# EAGLE schematic REM_Scan_v2 (EAGLE 9.6.2)

## Sheet 1 of 5
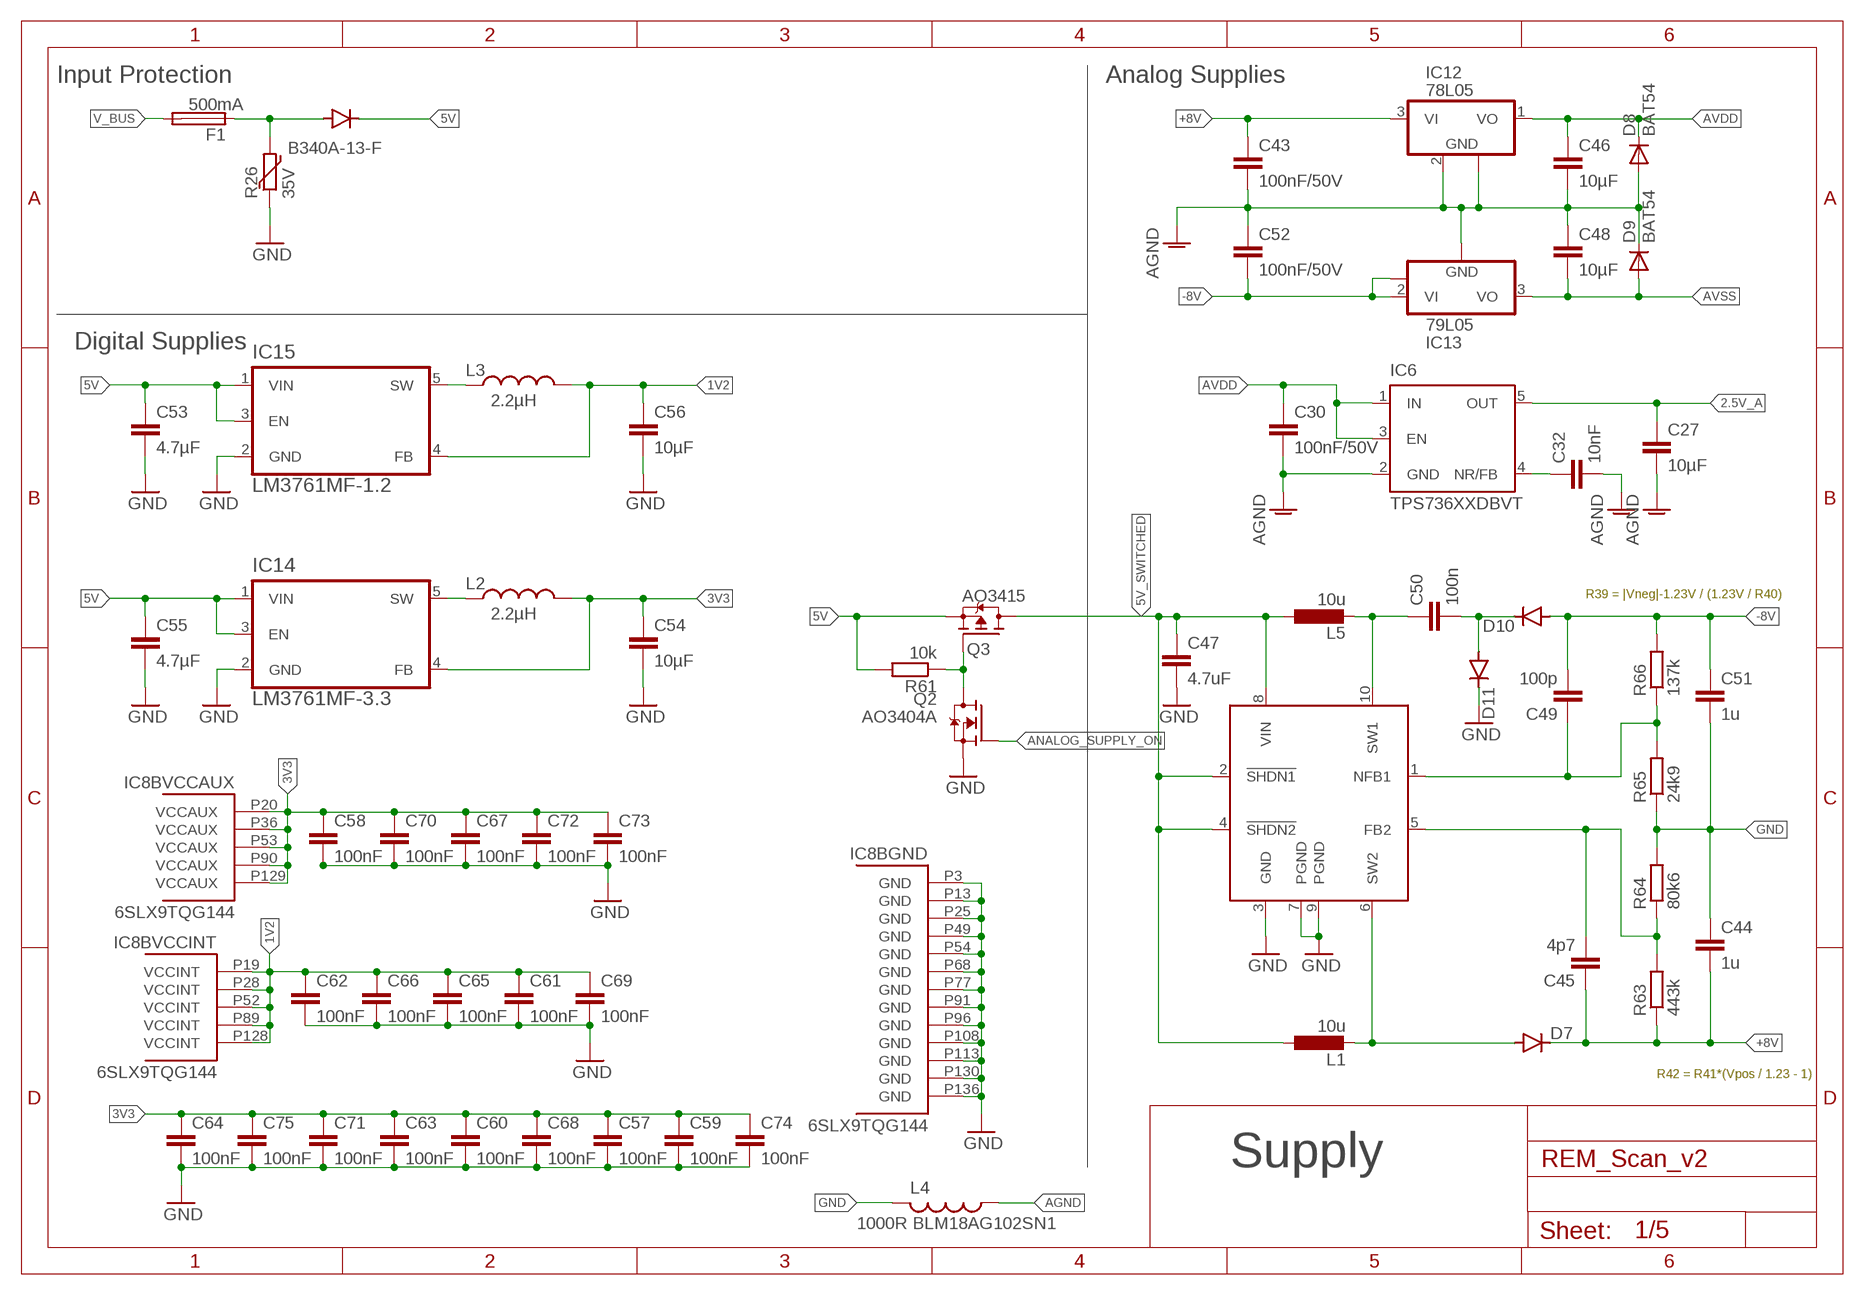
[diagram p0: schematic, sheet 1]

### Parts
C27  10µF  C-EUC0603  [C0603]
C30  100nF/50V  C-EUC0603  [C0603]
C32  10nF  C-EUC0603  [C0603]
C43  100nF/50V  C-EUC0603  [C0603]
C44  1u  C-EUC1206  [C1206]
C45  4p7  C-EUC0603  [C0603]
C46  10µF  C-EUC0603  [C0603]
C47  4.7uF  C-EUC3225  [C3225]
C48  10µF  C-EUC0603  [C0603]
C49  100p  C-EUC0603  [C0603]
C50  100n  C-EUC0603  [C0603]
C51  1u  C-EUC1206  [C1206]
C52  100nF/50V  C-EUC0603  [C0603]
C53  4.7µF  C-EUC0603  [C0603]
C54  10µF  C-EUC0603  [C0603]
C55  4.7µF  C-EUC0603  [C0603]
C56  10µF  C-EUC0603  [C0603]
C57  100nF  C-EUC0603  [C0603]
C58  100nF  C-EUC0603  [C0603]
C59  100nF  C-EUC0603  [C0603]
C60  100nF  C-EUC0603  [C0603]
C61  100nF  C-EUC0603  [C0603]
C62  100nF  C-EUC0603  [C0603]
C63  100nF  C-EUC0603  [C0603]
C64  100nF  C-EUC0603  [C0603]
C65  100nF  C-EUC0603  [C0603]
C66  100nF  C-EUC0603  [C0603]
C67  100nF  C-EUC0603  [C0603]
C68  100nF  C-EUC0603  [C0603]
C69  100nF  C-EUC0603  [C0603]
C70  100nF  C-EUC0603  [C0603]
C71  100nF  C-EUC0603  [C0603]
C72  100nF  C-EUC0603  [C0603]
C73  100nF  C-EUC0603  [C0603]
C74  100nF  C-EUC0603  [C0603]
C75  100nF  C-EUC0603  [C0603]
D3  B340A-13-F  DIODE-DO214AA  [DO214AA]
D7  DIODE-SOD323-W  [SOD323-W]
D8  BAT54  DIODE-SOD323-W  [SOD323-W]
D9  BAT54  DIODE-SOD323-W  [SOD323-W]
D10  DIODE-SOD323-W  [SOD323-W]
D11  DIODE-SOD323-W  [SOD323-W]
F1  500mA  FUSE1812  [1812]
IC6  TPS736XXDBVT  [SOT23-DBV]
IC8  6SLX9TQG144  [TQ144]
IC12  78L05  78L05F  [SOT89]
IC13  79L05  79L  [SOT89]
IC14  LM3761MF-3.3  LM3671  [SOT95P284X122-5N]
IC15  LM3761MF-1.2  LM3671  [SOT95P284X122-5N]
IC16  LT1945  [MSOP10]
L1  10u  L-EUL3225P  [L3225P]
L2  2.2µH  DO3314  [SO3314]
L3  2.2µH  DO3314  [SO3314]
L4  1000R BLM18AG102SN1  L-USL2012C  [L2012C]
L5  10u  L-EUL3225P  [L3225P]
Q2  AO3404A  N-MOSFET-SOT23-3  [SOT23]
Q3  AO3415  TSM2311CX  [SOT95P280X130-3N]
R26  35V  MOV-EU_1206  [R1206]
R61  10k  R-EU_R0603  [R0603]
R63  443k  R-EU_R0603  [R0603]
R64  80k6  R-EU_R0603  [R0603]
R65  24k9  R-EU_R0603  [R0603]
R66  137k  R-EU_R0603  [R0603]

### Nets
1V2: C56.1 C61.1 C62.1 C65.1 C66.1 C69.1 IC8.P19(BVCCINT:VCCINT) IC8.P28(BVCCINT:VCCINT) IC8.P52(BVCCINT:VCCINT) IC8.P89(BVCCINT:VCCINT) IC8.P128(BVCCINT:VCCINT) IC15.4(FB) L3.2
2.5V_A: C27.1 IC6.5(OUT) ; also sheet 3
3V3: C54.1 C57.1 C58.1 C59.1 C60.1 C63.1 C64.1 C67.1 C68.1 C70.1 C71.1 C72.1 C73.1 C74.1 C75.1 IC8.P20(BVCCAUX:VCCAUX) IC8.P36(BVCCAUX:VCCAUX) IC8.P53(BVCCAUX:VCCAUX) IC8.P90(BVCCAUX:VCCAUX) IC8.P129(BVCCAUX:VCCAUX) IC14.4(FB) L2.2 ; also sheet 2,3,4,5
5V: C53.1 C55.1 D3.C IC14.1(VIN) IC14.3(EN) IC15.1(VIN) IC15.3(EN) Q3.2(S) R61.2 ; also sheet 2
5V_SWITCHED: C47.1 IC16.2(!SHDN1) IC16.4(!SHDN2) IC16.8(VIN) L1.1 L5.1 Q3.3(D)
+8V: C43.1 C44.2 C45.1 D7.C IC12.3(VI) R63.1 ; also sheet 3
-8V: C49.2 C51.1 C52.2 D10.A IC13.2(VI) IC13.2@1(VIN) R66.2
AGND: C27.2 C30.2 C32.2 C43.2 C46.2 C48.1 C52.1 D8.A D9.C IC6.2(GND) IC12.2(GND) IC12.2@1(GND) IC13.1(GND) L4.1 ; also sheet 2,3,4
ANALOG_SUPPLY_ON: Q2.1(G) ; also sheet 2
AVDD: C30.1 C46.1 D8.C IC6.1(IN) IC6.3(EN) IC12.1(VO) ; also sheet 3,4
AVSS: C48.2 D9.A IC13.3(VO) ; also sheet 3,4
GND: C44.1 C47.2 C51.2 C53.2 C54.2 C55.2 C56.2 C57.2 C58.2 C59.2 C60.2 C61.2 C62.2 C63.2 C64.2 C65.2 C66.2 C67.2 C68.2 C69.2 C70.2 C71.2 C72.2 C73.2 C74.2 C75.2 D11.C IC8.P3(BGND:GND) IC8.P13(BGND:GND) IC8.P25(BGND:GND) IC8.P49(BGND:GND) IC8.P54(BGND:GND) IC8.P68(BGND:GND) IC8.P77(BGND:GND) IC8.P91(BGND:GND) IC8.P96(BGND:GND) IC8.P108(BGND:GND) IC8.P113(BGND:GND) IC8.P130(BGND:GND) IC8.P136(BGND:GND) IC14.2(GND) IC15.2(GND) IC16.3(GND) IC16.7(PGND) IC16.9(PGND) L4.2 Q2.2(S) R26.1 R64.2 R65.1 ; also sheet 2,3,4,5
N$3: IC15.5(SW) L3.1
N$00014: C32.1 IC6.4(NR/FB)
N$00016: C50.1 IC16.10(SW1) L5.2
N$00018: C50.2 D10.C D11.A
N$00019: D7.A IC16.6(SW2) L1.2
N$00029: C49.1 IC16.1(NFB1) R65.2 R66.1
N$00031: Q2.3(D) Q3.1(G) R61.1
N$00032: C45.2 IC16.5(FB2) R63.2 R64.1
N$50: IC14.5(SW) L2.1
SUPPLY_SEC: D3.A F1.1 R26.2
V_BUS: F1.2 ; also sheet 5

### Notes on the sheet
- Input Protection | Analog Supplies
- Digital Supplies
- R39 = |Vneg|-1.23V / (1.23V / R40)
- R42 = R41*(Vpos / 1.23 - 1)
- Supply

## Sheet 2 of 5
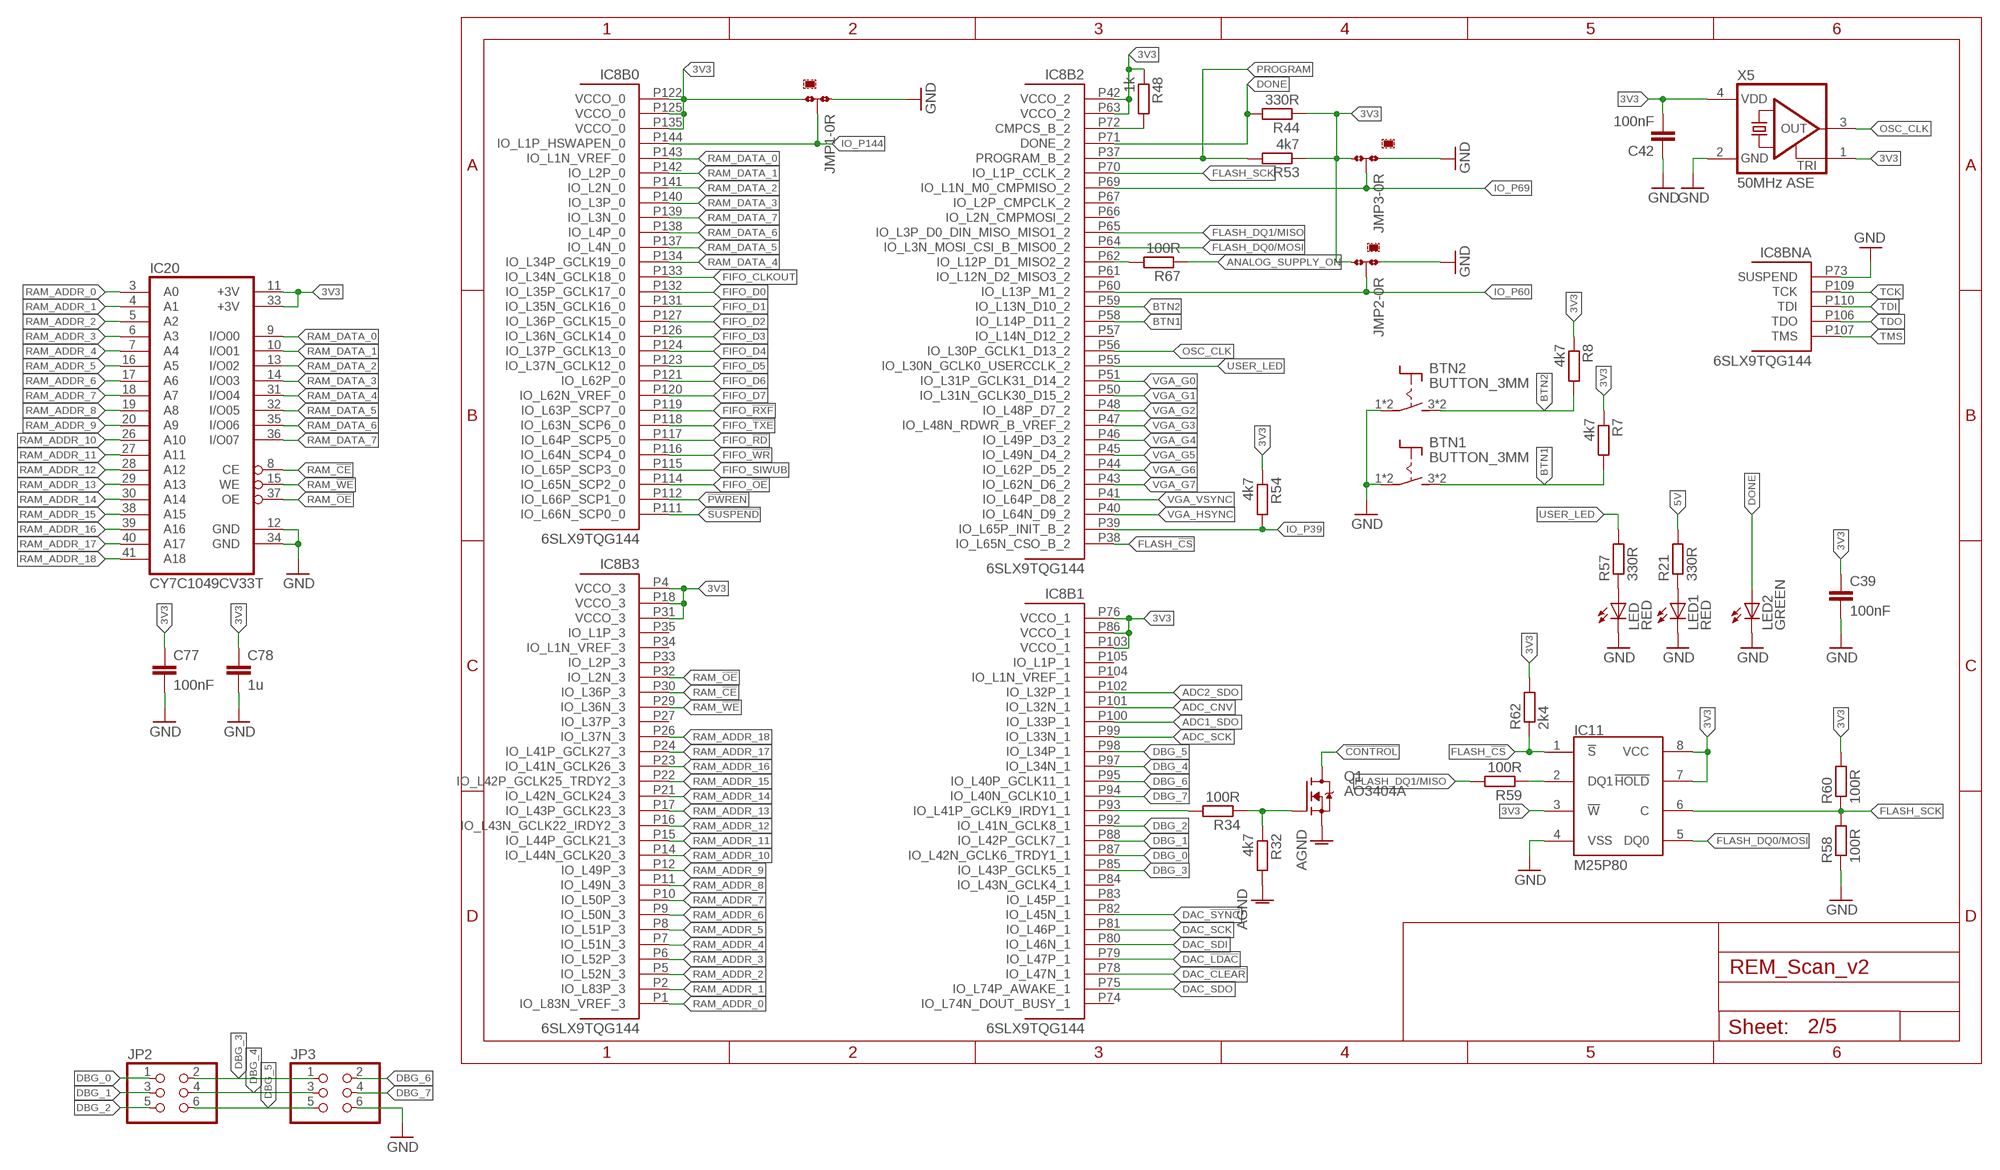
[diagram p1: schematic, sheet 2]

### Parts
BTN1  BUTTON_3MM  [BUTTON_3MM]
BTN2  BUTTON_3MM  [BUTTON_3MM]
C39  100nF  C-EUC0603  [C0603]
C42  100nF  C-EUC0603  [C0603]
C77  100nF  C-EUC0603  [C0603]
C78  1u  C-EUC1206  [C1206]
IC11  M25P80  [SO-08]
IC20  CY7C1049CV33T  [TSOPII-Z44]
JMP1  1k  0R-JUMPA  [A0R-JMP]
JMP2  1k  0R-JUMPA  [A0R-JMP]
JMP3  1k  0R-JUMPA  [A0R-JMP]
JP2  PINHD-2X3_2.54  [2X03]
JP3  PINHD-2X3_2.54  [2X03]
LED  RED  LEDCHIP-LED0603  [CHIP-LED0603]
LED1  RED  LEDCHIP-LED0603  [CHIP-LED0603]
LED2  GREEN  LEDCHIP-LED0603  [CHIP-LED0603]
Q1  AO3404A  N-MOSFET-SOT23-3  [SOT23]
R7  4k7  R-EU_R0603  [R0603]
R8  4k7  R-EU_R0603  [R0603]
R21  330R  R-EU_R0603  [R0603]
R32  4k7  R-EU_R0603  [R0603]
R34  100R  R-EU_R0603  [R0603]
R44  330R  R-EU_R0603  [R0603]
R48  1k  R-EU_R0603  [R0603]
R53  4k7  R-EU_R0603  [R0603]
R54  4k7  R-EU_R0603  [R0603]
R57  330R  R-EU_R0603  [R0603]
R58  100R  R-EU_R0603  [R0603]
R59  100R  R-EU_R0603  [R0603]
R60  100R  R-EU_R0603  [R0603]
R62  2k4  R-EU_R0603  [R0603]
R67  100R  R-EU_R0603  [R0603]
X5  50MHz ASE  ASE  [ASE]

### Nets
3V3: C39.1 C42.2 C77.1 C78.1 IC8.P4(B3:VCCO_3) IC8.P18(B3:VCCO_3) IC8.P31(B3:VCCO_3) IC8.P42(B2:VCCO_2) IC8.P63(B2:VCCO_2) IC8.P76(B1:VCCO_1) IC8.P86(B1:VCCO_1) IC8.P103(B1:VCCO_1) IC8.P122(B0:VCCO_0) IC8.P125(B0:VCCO_0) IC8.P135(B0:VCCO_0) IC11.3(!W) IC11.7(!HOLD) IC11.8(VCC) IC20.11(+3V) IC20.33(+3V) JMP1.3 JMP2.3 JMP3.3 R7.1 R8.1 R44.1 R48.1 R53.1 R54.1 R60.2 R62.2 X5.1(TRI) X5.4(VDD) ; also sheet 1,3,4,5
5V: R21.2 ; also sheet 1
!CONTROL: Q1.3(D) ; also sheet 4
!PWREN: IC8.P112(B0:IO_L66P_SCP1_0) ; also sheet 5
!SUSPEND: IC8.P111(B0:IO_L66N_SCP0_0) ; also sheet 5
ADC1_SDO: IC8.P100(B1:IO_L33P_1) ; also sheet 3
ADC2_SDO: IC8.P102(B1:IO_L32P_1) ; also sheet 3
ADC_CNV: IC8.P101(B1:IO_L32N_1) ; also sheet 3
ADC_SCK: IC8.P99(B1:IO_L33N_1) ; also sheet 3
AGND: Q1.2(S) R32.2 ; also sheet 1,3,4
ANALOG_SUPPLY_ON: R67.1 ; also sheet 1
BTN1: BTN1.3(S) BTN1.4(S) IC8.P58(B2:IO_L14P_D11_2) R7.2
BTN2: BTN2.3(S) BTN2.4(S) IC8.P59(B2:IO_L13N_D10_2) R8.2
DAC_!CLEAR: IC8.P78(B1:IO_L47N_1) ; also sheet 4
DAC_!LDAC: IC8.P79(B1:IO_L47P_1) ; also sheet 4
DAC_!SYNC: IC8.P82(B1:IO_L45N_1) ; also sheet 4
DAC_SCK: IC8.P81(B1:IO_L46P_1) ; also sheet 4
DAC_SDI: IC8.P80(B1:IO_L46N_1) ; also sheet 4
DAC_SDO: IC8.P75(B1:IO_L74P_AWAKE_1) ; also sheet 4
DBG_0: IC8.P87(B1:IO_L42N_GCLK6_TRDY1_1) JP2.1
DBG_1: IC8.P88(B1:IO_L42P_GCLK7_1) JP2.3
DBG_2: IC8.P92(B1:IO_L41N_GCLK8_1) JP2.5
DBG_3: IC8.P85(B1:IO_L43P_GCLK5_1) JP2.2 JP3.1
DBG_4: IC8.P97(B1:IO_L34N_1) JP2.4 JP3.3
DBG_5: IC8.P98(B1:IO_L34P_1) JP2.6 JP3.5
DBG_6: IC8.P95(B1:IO_L40P_GCLK11_1) JP3.2
DBG_7: IC8.P94(B1:IO_L40N_GCLK10_1) JP3.4
DONE: IC8.P71(B2:DONE_2) LED2.A R44.2
FIFO_!OE: IC8.P114(B0:IO_L65N_SCP2_0) ; also sheet 5
FIFO_!RD: IC8.P117(B0:IO_L64P_SCP5_0) ; also sheet 5
FIFO_!RXF: IC8.P119(B0:IO_L63P_SCP7_0) ; also sheet 5
FIFO_!TXE: IC8.P118(B0:IO_L63N_SCP6_0) ; also sheet 5
FIFO_!WR: IC8.P116(B0:IO_L64N_SCP4_0) ; also sheet 5
FIFO_CLKOUT: IC8.P133(B0:IO_L34N_GCLK18_0) ; also sheet 5
FIFO_D0: IC8.P132(B0:IO_L35P_GCLK17_0) ; also sheet 5
FIFO_D1: IC8.P131(B0:IO_L35N_GCLK16_0) ; also sheet 5
FIFO_D2: IC8.P127(B0:IO_L36P_GCLK15_0) ; also sheet 5
FIFO_D3: IC8.P126(B0:IO_L36N_GCLK14_0) ; also sheet 5
FIFO_D4: IC8.P124(B0:IO_L37P_GCLK13_0) ; also sheet 5
FIFO_D5: IC8.P123(B0:IO_L37N_GCLK12_0) ; also sheet 5
FIFO_D6: IC8.P121(B0:IO_L62P_0) ; also sheet 5
FIFO_D7: IC8.P120(B0:IO_L62N_VREF_0) ; also sheet 5
FIFO_SIWUB: IC8.P115(B0:IO_L65P_SCP3_0) ; also sheet 5
FLASH_!CS: IC8.P38(B2:IO_L65N_CSO_B_2) IC11.1(!S) R62.1
FLASH_DQ0/MOSI: IC8.P64(B2:IO_L3N_MOSI_CSI_B_MISO0_2) IC11.5(DQ0)
FLASH_DQ1/MISO: IC8.P65(B2:IO_L3P_D0_DIN_MISO_MISO1_2) R59.2
FLASH_SCK: IC8.P70(B2:IO_L1P_CCLK_2) IC11.6(C) R58.2 R60.1
GND: BTN1.1(P) BTN1.2(P) BTN2.1(P) BTN2.2(P) C39.2 C42.1 C77.2 C78.2 IC8.P73(BNA:SUSPEND) IC11.4(VSS) IC20.12(GND) IC20.34(GND) JMP1.1 JMP2.1 JMP3.1 JP3.6 LED1.C LED2.C LED.C R58.1 X5.2(GND) ; also sheet 1,3,4,5
IO_P39: IC8.P39(B2:IO_L65P_INIT_B_2) R54.2
IO_P60: IC8.P60(B2:IO_L13P_M1_2) JMP2.2
IO_P69: IC8.P69(B2:IO_L1N_M0_CMPMISO_2) JMP3.2
IO_P144: IC8.P144(B0:IO_L1P_HSWAPEN_0) JMP1.2
N$1: IC11.2(DQ1) R59.1
N$5: LED1.A R21.1
N$00006: Q1.1(G) R32.1 R34.1
N$7: IC8.P72(B2:CMPCS_B_2) R48.2
N$00008: IC8.P93(B1:IO_L41P_GCLK9_IRDY1_1) R34.2
N$00030: LED.A R57.1
N$00035: IC8.P62(B2:IO_L12P_D1_MISO2_2) R67.2
OSC_CLK: IC8.P56(B2:IO_L30P_GCLK1_D13_2) X5.3(OUT)
PROGRAM: IC8.P37(B2:PROGRAM_B_2) R53.2
RAM_!CE: IC8.P30(B3:IO_L36P_3) IC20.8(CE)
RAM_!OE: IC8.P32(B3:IO_L2N_3) IC20.37(OE)
RAM_!WE: IC8.P29(B3:IO_L36N_3) IC20.15(WE)
RAM_ADDR_0: IC8.P1(B3:IO_L83N_VREF_3) IC20.3(A0)
RAM_ADDR_1: IC8.P2(B3:IO_L83P_3) IC20.4(A1)
RAM_ADDR_2: IC8.P5(B3:IO_L52N_3) IC20.5(A2)
RAM_ADDR_3: IC8.P6(B3:IO_L52P_3) IC20.6(A3)
RAM_ADDR_4: IC8.P7(B3:IO_L51N_3) IC20.7(A4)
RAM_ADDR_5: IC8.P8(B3:IO_L51P_3) IC20.16(A5)
RAM_ADDR_6: IC8.P9(B3:IO_L50N_3) IC20.17(A6)
RAM_ADDR_7: IC8.P10(B3:IO_L50P_3) IC20.18(A7)
RAM_ADDR_8: IC8.P11(B3:IO_L49N_3) IC20.19(A8)
RAM_ADDR_9: IC8.P12(B3:IO_L49P_3) IC20.20(A9)
RAM_ADDR_10: IC8.P14(B3:IO_L44N_GCLK20_3) IC20.26(A10)
RAM_ADDR_11: IC8.P15(B3:IO_L44P_GCLK21_3) IC20.27(A11)
RAM_ADDR_12: IC8.P16(B3:IO_L43N_GCLK22_IRDY2_3) IC20.28(A12)
RAM_ADDR_13: IC8.P17(B3:IO_L43P_GCLK23_3) IC20.29(A13)
RAM_ADDR_14: IC8.P21(B3:IO_L42N_GCLK24_3) IC20.30(A14)
RAM_ADDR_15: IC8.P22(B3:IO_L42P_GCLK25_TRDY2_3) IC20.38(A15)
RAM_ADDR_16: IC8.P23(B3:IO_L41N_GCLK26_3) IC20.39(A16)
RAM_ADDR_17: IC8.P24(B3:IO_L41P_GCLK27_3) IC20.40(A17)
RAM_ADDR_18: IC8.P26(B3:IO_L37N_3) IC20.41(A18)
RAM_DATA_0: IC8.P143(B0:IO_L1N_VREF_0) IC20.9(I/O00)
RAM_DATA_1: IC8.P142(B0:IO_L2P_0) IC20.10(I/O01)
RAM_DATA_2: IC8.P141(B0:IO_L2N_0) IC20.13(I/O02)
RAM_DATA_3: IC8.P140(B0:IO_L3P_0) IC20.14(I/O03)
RAM_DATA_4: IC8.P134(B0:IO_L34P_GCLK19_0) IC20.31(I/O04)
RAM_DATA_5: IC8.P137(B0:IO_L4N_0) IC20.32(I/O05)
RAM_DATA_6: IC8.P138(B0:IO_L4P_0) IC20.35(I/O06)
RAM_DATA_7: IC8.P139(B0:IO_L3N_0) IC20.36(I/O07)
TCK: IC8.P109(BNA:TCK) ; also sheet 5
TDI: IC8.P110(BNA:TDI) ; also sheet 5
TDO: IC8.P106(BNA:TDO) ; also sheet 5
TMS: IC8.P107(BNA:TMS) ; also sheet 5
USER_LED: IC8.P55(B2:IO_L30N_GCLK0_USERCCLK_2) R57.2
VGA_G0: IC8.P51(B2:IO_L31P_GCLK31_D14_2) ; also sheet 4
VGA_G1: IC8.P50(B2:IO_L31N_GCLK30_D15_2) ; also sheet 4
VGA_G2: IC8.P48(B2:IO_L48P_D7_2) ; also sheet 4
VGA_G3: IC8.P47(B2:IO_L48N_RDWR_B_VREF_2) ; also sheet 4
VGA_G4: IC8.P46(B2:IO_L49P_D3_2) ; also sheet 4
VGA_G5: IC8.P45(B2:IO_L49N_D4_2) ; also sheet 4
VGA_G6: IC8.P44(B2:IO_L62P_D5_2) ; also sheet 4
VGA_G7: IC8.P43(B2:IO_L62N_D6_2) ; also sheet 4
VGA_HSYNC: IC8.P40(B2:IO_L64N_D9_2) ; also sheet 4
VGA_VSYNC: IC8.P41(B2:IO_L64P_D8_2) ; also sheet 4
Unconnected: IC8.P27(B3:IO_L37P_3) IC8.P33(B3:IO_L2P_3) IC8.P34(B3:IO_L1N_VREF_3) IC8.P35(B3:IO_L1P_3) IC8.P57(B2:IO_L14N_D12_2) IC8.P61(B2:IO_L12N_D2_MISO3_2) IC8.P66(B2:IO_L2N_CMPMOSI_2) IC8.P67(B2:IO_L2P_CMPCLK_2) IC8.P74(B1:IO_L74N_DOUT_BUSY_1) IC8.P83(B1:IO_L45P_1) IC8.P84(B1:IO_L43N_GCLK4_1) IC8.P104(B1:IO_L1N_VREF_1) IC8.P105(B1:IO_L1P_1)

## Sheet 3 of 5
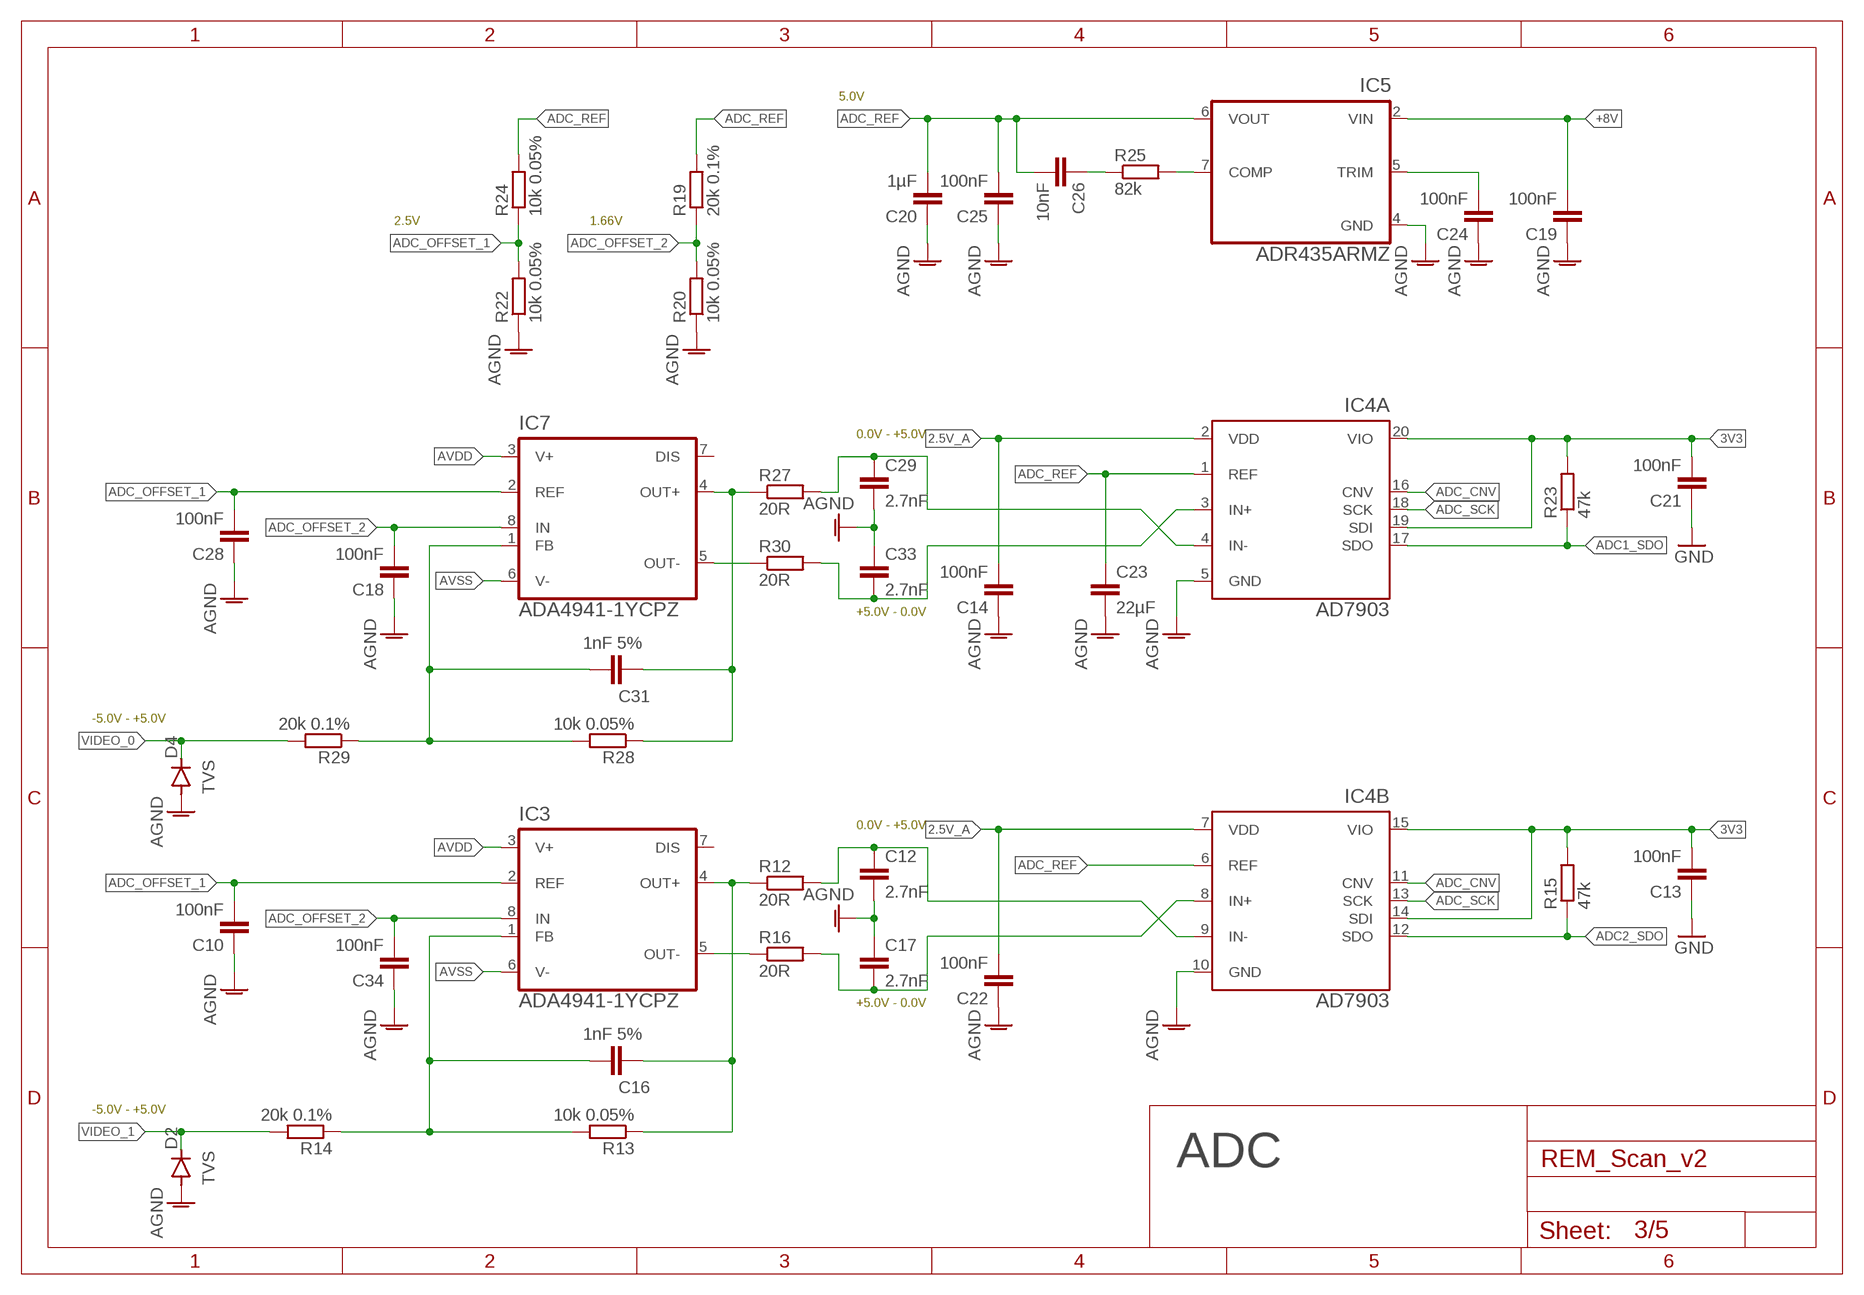
[diagram p2: schematic, sheet 3]

### Parts
C10  100nF  C-EUC0603  [C0603]
C12  2.7nF  C-EUC0603K  [C0603K]
C13  100nF  C-EUC0603  [C0603]
C14  100nF  C-EUC0603  [C0603]
C16  1nF 5%  C-EUC0603  [C0603]
C17  2.7nF  C-EUC0603K  [C0603K]
C18  100nF  C-EUC0603  [C0603]
C19  100nF  C-EUC0603  [C0603]
C20  1µF  C-EUC0603  [C0603]
C21  100nF  C-EUC0603  [C0603]
C22  100nF  C-EUC0603  [C0603]
C23  22µF  C-EUC0805K  [C0805K]
C24  100nF  C-EUC0603  [C0603]
C25  100nF  C-EUC0603  [C0603]
C26  10nF  C-EUC0603  [C0603]
C28  100nF  C-EUC0603  [C0603]
C29  2.7nF  C-EUC0603K  [C0603K]
C31  1nF 5%  C-EUC0603  [C0603]
C33  2.7nF  C-EUC0603K  [C0603K]
C34  100nF  C-EUC0603  [C0603]
D2  TVS  DIODE-SOD123  [SOD123]
D4  TVS  DIODE-SOD123  [SOD123]
IC3  ADA4941-1YCPZ  [LFCSP_VD8_CP-8-2]
IC4  AD7903  [RQ-20]
IC5  ADR435ARMZ  [MSOP08]
IC7  ADA4941-1YCPZ  [LFCSP_VD8_CP-8-2]
R12  20R  R-EU_R0603  [R0603]
R13  10k 0.05%  R-EU_R0603  [R0603]
R14  20k 0.1%  R-EU_R0603  [R0603]
R15  47k  R-EU_R0603  [R0603]
R16  20R  R-EU_R0603  [R0603]
R19  20k 0.1%  R-EU_R0603  [R0603]
R20  10k 0.05%  R-EU_R0603  [R0603]
R22  10k 0.05%  R-EU_R0603  [R0603]
R23  47k  R-EU_R0603  [R0603]
R24  10k 0.05%  R-EU_R0603  [R0603]
R25  82k  R-EU_R0603  [R0603]
R27  20R  R-EU_R0603  [R0603]
R28  10k 0.05%  R-EU_R0603  [R0603]
R29  20k 0.1%  R-EU_R0603  [R0603]
R30  20R  R-EU_R0603  [R0603]

### Nets
2.5V_A: C14.2 C22.2 IC4.2(A:VDD) IC4.7(B:VDD) ; also sheet 1
3V3: C13.2 C21.2 IC4.14(B:SDI) IC4.15(B:VIO) IC4.19(A:SDI) IC4.20(A:VIO) R15.2 R23.2 ; also sheet 1,2,4,5
+8V: C19.2 IC5.2(VIN) ; also sheet 1
ADC1_SDO: IC4.17(A:SDO) R23.1 ; also sheet 2
ADC2_SDO: IC4.12(B:SDO) R15.1 ; also sheet 2
ADC_CNV: IC4.11(B:CNV) IC4.16(A:CNV) ; also sheet 2
ADC_OFFSET_1: C10.2 C28.2 IC3.2(REF) IC7.2(REF) R22.2 R24.1
ADC_OFFSET_2: C18.2 C34.2 IC3.8(IN) IC7.8(IN) R19.1 R20.2
ADC_REF: C20.2 C23.1 C25.2 C26.2 IC4.1(A:REF) IC4.6(B:REF) IC5.6(VOUT) R19.2 R24.2
ADC_SCK: IC4.13(B:SCK) IC4.18(A:SCK) ; also sheet 2
AGND: C10.1 C12.2 C14.1 C17.1 C18.1 C19.1 C20.1 C22.1 C23.2 C24.1 C25.1 C28.1 C29.2 C33.1 C34.1 D2.A D4.A IC4.5(A:GND) IC4.10(B:GND) IC5.4(GND) R20.1 R22.1 ; also sheet 1,2,4
AVDD: IC3.3(V+) IC7.3(V+) ; also sheet 1,4
AVSS: IC3.6(V-) IC7.6(V-) ; also sheet 1,4
GND: C13.1 C21.1 ; also sheet 1,2,4,5
N$00002: C12.1 IC4.9(B:IN-) R12.2
N$00004: C17.2 IC4.8(B:IN+) R16.2
N$00009: C31.1 IC7.4(OUT+) R27.1 R28.1
N$00010: IC7.5(OUT-) R30.1
N$00011: C29.1 IC4.4(A:IN-) R27.2
N$00012: C33.2 IC4.3(A:IN+) R30.2
N$00013: C16.1 IC3.4(OUT+) R12.1 R13.1
N$00039: IC3.5(OUT-) R16.1
N$00047: C24.2 IC5.5(TRIM)
N$00053: IC5.7(COMP) R25.2
N$00054: C26.1 R25.1
N$00055: C31.2 IC7.1(FB) R28.2 R29.1
N$00057: C16.2 IC3.1(FB) R13.2 R14.1
VIDEO_0: D4.C R29.2 ; also sheet 4
VIDEO_1: D2.C R14.2 ; also sheet 4
Unconnected: IC3.7(DIS) IC7.7(DIS)

### Notes on the sheet
- 5.0V
- 2.5V | 1.66V
- 0.0V - +5.0V
- +5.0V - 0.0V
- -5.0V - +5.0V
- 0.0V - +5.0V
- +5.0V - 0.0V
- -5.0V - +5.0V
- ADC

## Sheet 4 of 5
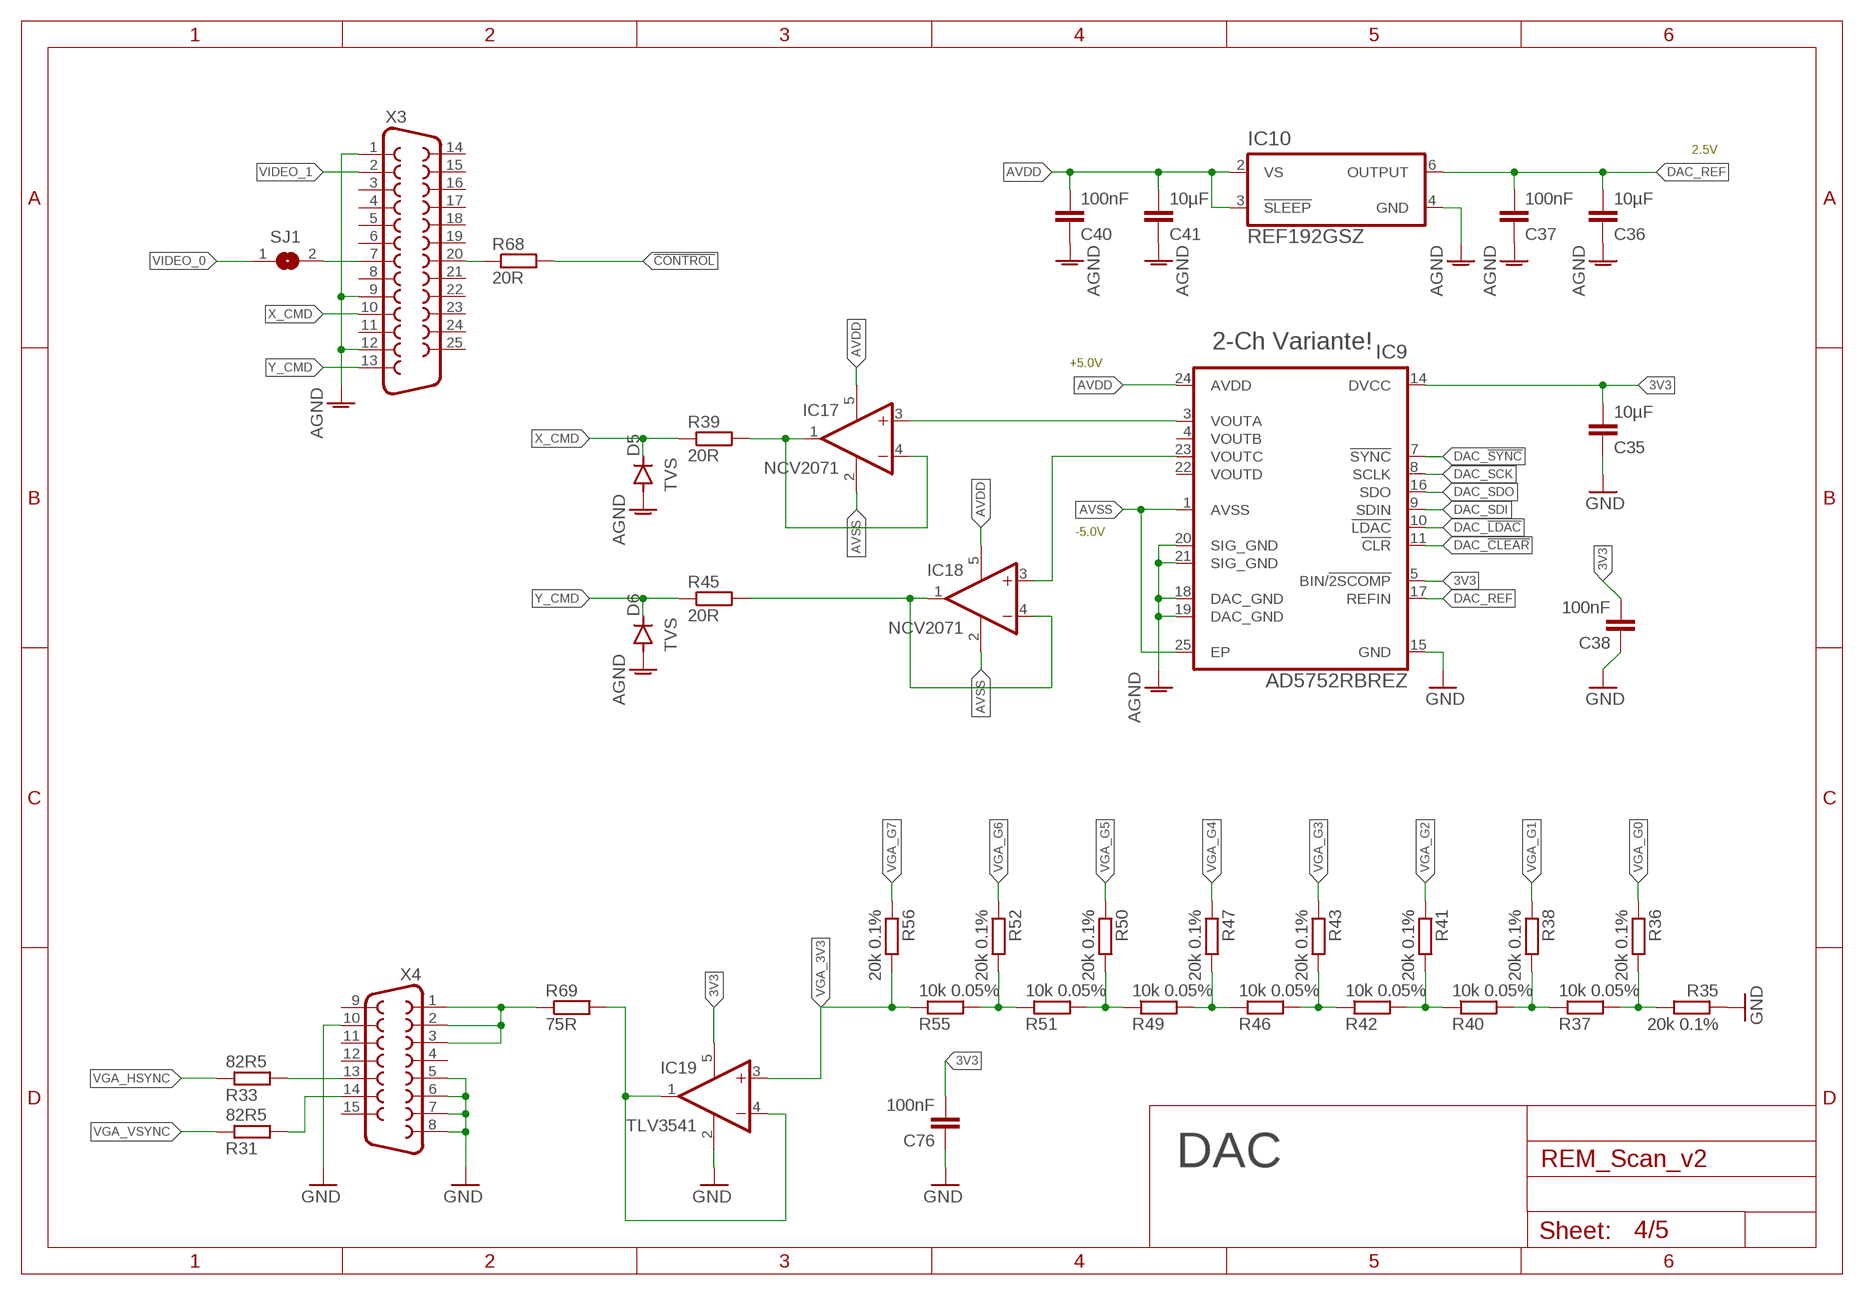
[diagram p3: schematic, sheet 4]

### Parts
C35  10µF  C-EUC0603  [C0603]
C36  10µF  C-EUC0603  [C0603]
C37  100nF  C-EUC0603  [C0603]
C38  100nF  C-EUC0603  [C0603]
C40  100nF  C-EUC0603  [C0603]
C41  10µF  C-EUC0603  [C0603]
C76  100nF  C-EUC0603  [C0603]
D5  TVS  DIODE-SOD123  [SOD123]
D6  TVS  DIODE-SOD123  [SOD123]
IC9  AD5752RBREZ  AD5754RBREZ  [SOP65P640X120-25N]
IC10  REF192GSZ  [SOIC127P600X175-8N]
IC17  NCV2071  OPA344N-SOT23  [SOT23-5]
IC18  NCV2071  OPA344N-SOT23  [SOT23-5]
IC19  TLV3541  OPA344N-SOT23  [SOT23-5]
R31  82R5  R-EU_R0603  [R0603]
R33  82R5  R-EU_R0603  [R0603]
R35  20k 0.1%  R-EU_R0603  [R0603]
R36  20k 0.1%  R-EU_R0603  [R0603]
R37  10k 0.05%  R-EU_R0603  [R0603]
R38  20k 0.1%  R-EU_R0603  [R0603]
R39  20R  R-EU_R0603  [R0603]
R40  10k 0.05%  R-EU_R0603  [R0603]
R41  20k 0.1%  R-EU_R0603  [R0603]
R42  10k 0.05%  R-EU_R0603  [R0603]
R43  20k 0.1%  R-EU_R0603  [R0603]
R45  20R  R-EU_R0603  [R0603]
R46  10k 0.05%  R-EU_R0603  [R0603]
R47  20k 0.1%  R-EU_R0603  [R0603]
R49  10k 0.05%  R-EU_R0603  [R0603]
R50  20k 0.1%  R-EU_R0603  [R0603]
R51  10k 0.05%  R-EU_R0603  [R0603]
R52  20k 0.1%  R-EU_R0603  [R0603]
R55  10k 0.05%  R-EU_R0603  [R0603]
R56  20k 0.1%  R-EU_R0603  [R0603]
R68  20R  R-EU_R0603  [R0603]
R69  75R  R-EU_R0603  [R0603]
SJ1  SJ  [SJ]
X3  F25HP  [F25HP]
X4  F15HDH  [HDF15H]

### Nets
3V3: C35.2 C38.2 C76.2 IC9.5(BIN/!2SCOMP) IC9.14(DVCC) IC19.5(V+) ; also sheet 1,2,3,5
!CONTROL: R68.2 ; also sheet 2
AGND: C36.1 C37.1 C40.1 C41.1 D5.A D6.A IC9.18(DAC_GND) IC9.19(DAC_GND) IC9.20(SIG_GND) IC9.21(SIG_GND) IC10.4(GND) X3.1 X3.9 X3.12 ; also sheet 1,2,3
AVDD: C40.2 C41.2 IC9.24(AVDD) IC10.2(VS) IC10.3(!SLEEP) IC17.5(V+) IC18.5(V+) ; also sheet 1,3
AVSS: IC9.1(AVSS) IC9.25(EP) IC17.2(V-) IC18.2(V-) ; also sheet 1,3
DAC_!CLEAR: IC9.11(!CLR) ; also sheet 2
DAC_!LDAC: IC9.10(!LDAC) ; also sheet 2
DAC_!SYNC: IC9.7(!SYNC) ; also sheet 2
DAC_REF: C36.2 C37.2 IC9.17(REFIN) IC10.6(OUTPUT)
DAC_SCK: IC9.8(SCLK) ; also sheet 2
DAC_SDI: IC9.9(SDIN) ; also sheet 2
DAC_SDO: IC9.16(SDO) ; also sheet 2
GND: C35.1 C38.1 C76.1 IC9.15(GND) IC19.2(V-) R35.1 X4.5 X4.6 X4.7 X4.8 X4.10 ; also sheet 1,2,3,5
N$00015: SJ1.2 X3.7
N$00017: R31.2 X4.14
N$00033: R69.1 X4.1 X4.2 X4.3
N$00034: R33.2 X4.13
N$00036: R35.2 R36.2 R37.2
N$00037: R37.1 R38.2 R40.2
N$00038: R40.1 R41.2 R42.2
N$00040: R42.1 R43.2 R46.2
N$00041: R46.1 R47.2 R49.2
N$00042: R49.1 R50.2 R51.2
N$00044: R51.1 R52.2 R55.2
N$00045: IC19.1(OUT) IC19.4(-IN) R69.2
N$00060: IC17.1(OUT) IC17.4(-IN) R39.2
N$00061: IC9.3(VOUTA) IC17.3(+IN)
N$00062: IC18.1(OUT) IC18.4(-IN) R45.2
N$00063: IC9.23(VOUTC) IC18.3(+IN)
N$00064: R68.1 X3.20
VGA_3V3: IC19.3(+IN) R55.1 R56.2
VGA_G0: R36.1 ; also sheet 2
VGA_G1: R38.1 ; also sheet 2
VGA_G2: R41.1 ; also sheet 2
VGA_G3: R43.1 ; also sheet 2
VGA_G4: R47.1 ; also sheet 2
VGA_G5: R50.1 ; also sheet 2
VGA_G6: R52.1 ; also sheet 2
VGA_G7: R56.1 ; also sheet 2
VGA_HSYNC: R33.1 ; also sheet 2
VGA_VSYNC: R31.1 ; also sheet 2
VIDEO_0: SJ1.1 ; also sheet 3
VIDEO_1: X3.2 ; also sheet 3
X_CMD: D5.C R39.1 X3.10
Y_CMD: D6.C R45.1 X3.13
Unconnected: IC9.4(VOUTB) IC9.22(VOUTD) X3.3 X3.4 X3.5 X3.6 X3.8 X3.11 X3.14 X3.15 X3.16 X3.17 X3.18 X3.19 X3.21 X3.22 X3.23 X3.24 X3.25 X4.4 X4.9 X4.11 X4.12 X4.15

### Notes on the sheet
- 2.5V
- 2-Ch Variante!
- +5.0V
- -5.0V
- DAC

## Sheet 5 of 5
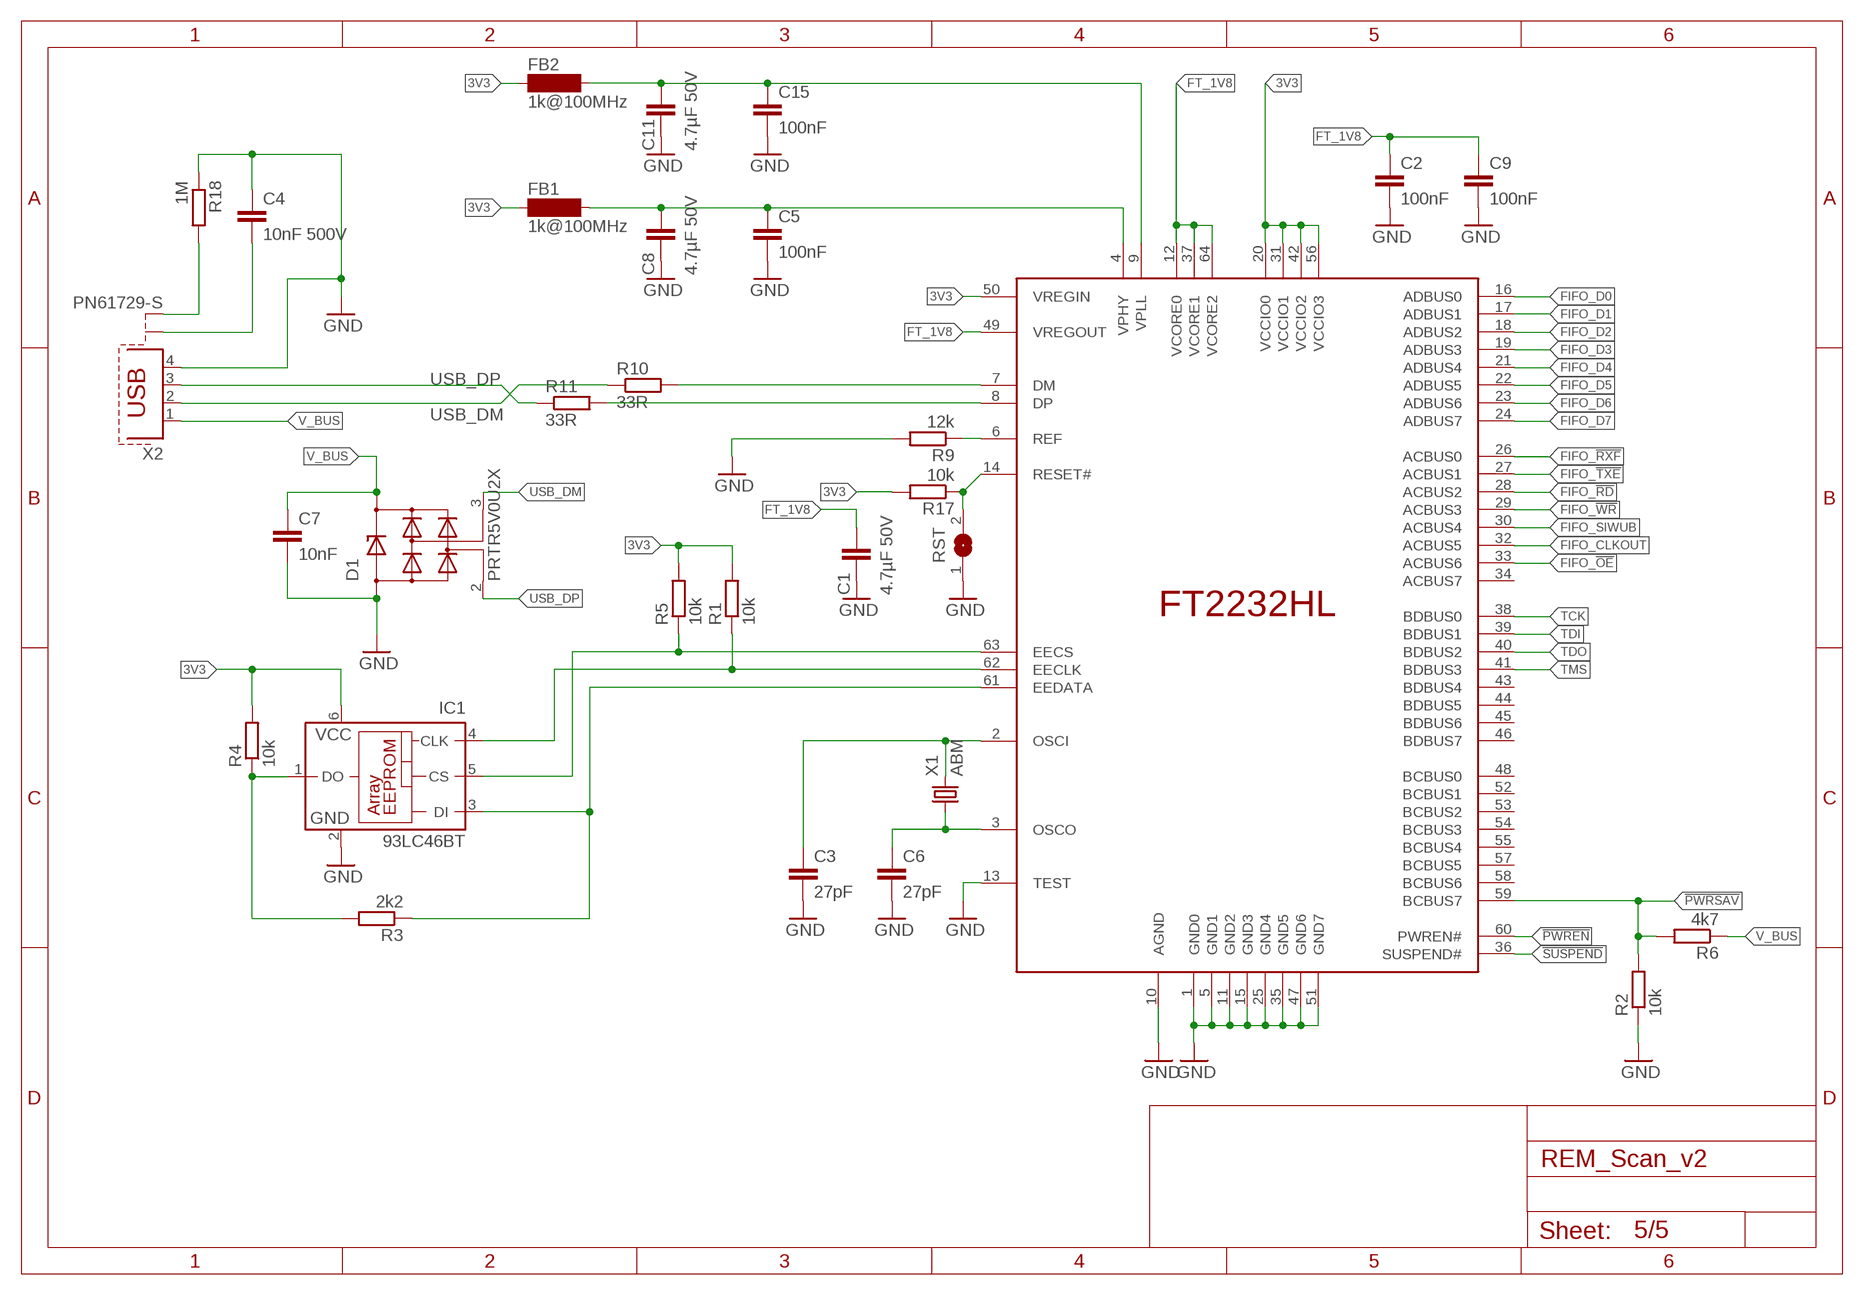
[diagram p4: schematic, sheet 5]

### Parts
C1  4.7µF 50V  C-EUC0805  [C0805]
C2  100nF  C-EUC0603  [C0603]
C3  27pF  C-EUC0603  [C0603]
C4  10nF 500V  C-EUC0805  [C0805]
C5  100nF  C-EUC0603  [C0603]
C6  27pF  C-EUC0603  [C0603]
C7  10nF  C-EUC0603  [C0603]
C8  4.7µF 50V  C-EUC0805  [C0805]
C9  100nF  C-EUC0603  [C0603]
C11  4.7µF 50V  C-EUC0805  [C0805]
C15  100nF  C-EUC0603  [C0603]
D1  PRTR5V0U2X  [SOT143]
FB1  1k@100MHz  SM-1206  [SM-1206]
FB2  1k@100MHz  SM-1206  [SM-1206]
IC1  93LC46BT  93C76B  [SOT23-6]
IC2  FT2232HL  [LQFP64]
R1  10k  R-EU_R0603  [R0603]
R2  10k  R-EU_R0603  [R0603]
R3  2k2  R-EU_R0603  [R0603]
R4  10k  R-EU_R0603  [R0603]
R5  10k  R-EU_R0603  [R0603]
R6  4k7  R-EU_R0603  [R0603]
R9  12k  R-EU_R0603  [R0603]
R10  33R  R-EU_R0603  [R0603]
R11  33R  R-EU_R0603  [R0603]
R17  10k  R-EU_R0603  [R0603]
R18  1M  R-EU_R0603  [R0603]
RST  SJS  [SJS]
X1  ABM  [ASE]
X2  PN61729-S  [PN61729-S]

### Nets
3V3: FB1.1 FB2.1 IC1.6(VCC) IC2.20(VCCIO0) IC2.31(VCCIO1) IC2.42(VCCIO2) IC2.50(VREGIN) IC2.56(VCCIO3) R1.2 R4.2 R5.2 R17.2 ; also sheet 1,2,3,4
!PWREN: IC2.60(PWREN#) ; also sheet 2
!PWRSAV: IC2.59(BCBUS7) R2.2 R6.2
!SUSPEND: IC2.36(SUSPEND#) ; also sheet 2
FIFO_!OE: IC2.33(ACBUS6) ; also sheet 2
FIFO_!RD: IC2.28(ACBUS2) ; also sheet 2
FIFO_!RXF: IC2.26(ACBUS0) ; also sheet 2
FIFO_!TXE: IC2.27(ACBUS1) ; also sheet 2
FIFO_!WR: IC2.29(ACBUS3) ; also sheet 2
FIFO_CLKOUT: IC2.32(ACBUS5) ; also sheet 2
FIFO_D0: IC2.16(ADBUS0) ; also sheet 2
FIFO_D1: IC2.17(ADBUS1) ; also sheet 2
FIFO_D2: IC2.18(ADBUS2) ; also sheet 2
FIFO_D3: IC2.19(ADBUS3) ; also sheet 2
FIFO_D4: IC2.21(ADBUS4) ; also sheet 2
FIFO_D5: IC2.22(ADBUS5) ; also sheet 2
FIFO_D6: IC2.23(ADBUS6) ; also sheet 2
FIFO_D7: IC2.24(ADBUS7) ; also sheet 2
FIFO_SIWUB: IC2.30(ACBUS4) ; also sheet 2
FT_1V8: C1.1 C2.1 C9.1 IC2.12(VCORE0) IC2.37(VCORE1) IC2.49(VREGOUT) IC2.64(VCORE2)
GND: C1.2 C2.2 C3.2 C4.1 C5.2 C6.2 C7.2 C8.2 C9.2 C11.2 C15.2 D1.1(GND) IC1.2(GND) IC2.1(GND0) IC2.5(GND1) IC2.10(AGND) IC2.11(GND2) IC2.13(TEST) IC2.15(GND3) IC2.25(GND4) IC2.35(GND5) IC2.47(GND6) IC2.51(GND7) R2.1 R9.2 R18.1 RST.1 X2.4 ; also sheet 1,2,3,4
N$00020: R18.2 X2.S2
N$00021: C4.2 X2.S1
N$00022: IC2.7(DM) R10.2
N$00023: IC2.8(DP) R11.2
N$00024: IC1.5(CS) IC2.63(EECS) R5.1
N$00025: IC1.4(CLK) IC2.62(EECLK) R1.1
N$00026: IC1.3(DI) IC2.61(EEDATA) R3.1
N$00027: C3.1 IC2.2(OSCI) X1.3
N$00028: C6.1 IC2.3(OSCO) X1.1
N$00043: IC1.1(DO) R3.2 R4.1
N$00046: IC2.14(RESET#) R17.1 RST.2
N$00049: IC2.6(REF) R9.1
TCK: IC2.38(BDBUS0) ; also sheet 2
TDI: IC2.39(BDBUS1) ; also sheet 2
TDO: IC2.40(BDBUS2) ; also sheet 2
TMS: IC2.41(BDBUS3) ; also sheet 2
USB_DM: D1.3(IO2) R10.1 X2.2
USB_DP: D1.2(IO1) R11.1 X2.3
V_BUS: C7.1 D1.4(VCC) R6.1 X2.1 ; also sheet 1
VPHY: C5.1 C8.1 FB1.2 IC2.4(VPHY)
VPLL: C11.1 C15.1 FB2.2 IC2.9(VPLL)
Unconnected: IC2.34(ACBUS7) IC2.43(BDBUS4) IC2.44(BDBUS5) IC2.45(BDBUS6) IC2.46(BDBUS7) IC2.48(BCBUS0) IC2.52(BCBUS1) IC2.53(BCBUS2) IC2.54(BCBUS3) IC2.55(BCBUS4) IC2.57(BCBUS5) IC2.58(BCBUS6)

## Power pins joined to a net without a drawn wire
GND: X1.2(GND) X1.4(GND)

## Library data of the parts
BTN1 BTN2 = Synth_Frontplate:BUTTON: Momentary Pusbutton
C1 C8 C11 = rcl:C-EU: CAPACITOR, European symbol; BUERKLIN: 53 D 3425; LAGERORT: 20/07; MBM: 10; PREIS: 0,61
C2 C3 C5 C6 C9 C15 C45 C49 C50 = rcl:C-EU: CAPACITOR, European symbol; SPICEPREFIX: C
C4 = rcl:C-EU: CAPACITOR, European symbol; BUERKLIN: 56D510; MBM: 1; PREIS: 0,13
C7 = rcl:C-EU: CAPACITOR, European symbol; BUERKLIN: 56D144; MBM: 1; PREIS: 0,04
C10 C13 C14 C18 C19 C21 C22 C24 C25 C28 C34 C37 C40 = rcl:C-EU: CAPACITOR, European symbol; BUERKLIN: 53 D 2071; MBM: 10; PREIS: 0,07
C12 C17 C29 C33 = rcl:C-EU: CAPACITOR, European symbol; FARNELL: 1759094; MBM: 10; PREIS: 0,0093
C16 C31 = rcl:C-EU: CAPACITOR, European symbol; FARNELL: 1789718; MBM: 1; PREIS: 0,38
C20 = rcl:C-EU: CAPACITOR, European symbol; FARNELL: 2496835; MBM: 10; PREIS: 0,0386
C23 = rcl:C-EU: CAPACITOR, European symbol; FARNELL: 1845739; MBM: 10; PREIS: 0,0102
C26 C32 = rcl:C-EU: CAPACITOR, European symbol; BUERKLIN: 56D144; MBM: 10; PREIS: 0,0073
C27 C35 C36 C41 C46 C48 = rcl:C-EU: CAPACITOR, European symbol; FARNELL: 2497051; MBM: 10; PREIS: 0,0533
C30 C43 C52 = rcl:C-EU: CAPACITOR, European symbol; BUERKLIN: 53D2071; MBM: 10; PREIS: 0,07
C38 C76 = rcl:C-EU: CAPACITOR, European symbol; BUERKLIN: 53D1726; MBM: 10; PREIS: 0,07
C39 C47 C77 = rcl:C-EU: CAPACITOR, European symbol
C42 = rcl:C-EU: CAPACITOR, European symbol; BUERKLIN: 53D2068; MBM: 10; PREIS: 0,04
C44 C51 C78 = rcl:C-EU: CAPACITOR, European symbol; DIGIKEY: 587-5596-1-ND; SPICEPREFIX: C
C53 C55 C57-C75 = rcl:C-EU: CAPACITOR, European symbol; BUERKLIN: 53D2086; MBM: 10; PREIS: 0,10
C54 C56 = rcl:C-EU: CAPACITOR, European symbol; BUERKLIN: 53D2088; MBM: 10; PREIS: 0,29
D1 = diode:PRTR5V0U2X: Ultra low capacitance double rail-to-rail ESD protection TVS diode; FARNELL: 1524157; MBM: 5; PREIS: 0,311
D2 D4-D6 = diode:DIODE-: DIODE; DIGIKEY: 641-1986-1-ND
D3 = diode:DIODE-: DIODE; FARNELL: 1843668; LAGERORT: 94/08; MBM: 1; PREIS: 0,446
D7 D10 D11 = diode:DIODE-: DIODE; DIGIKEY: 1514-CMDSH05-4TRPBFREECT-ND
D8 D9 = diode:DIODE-: DIODE; FARNELL: 1459033; MBM: 5; PREIS: 0,169
F1 = fuse:FUSE: Fuse; DIGIKEY: F8132CT-ND
FB1 FB2 = inductor-neosid:SM-1206: INDUCTOR SMD chip inductor; FARNELL: 1635759; MBM: 1; OC_FARNELL: unknown; OC_NEWARK: unknown; PREIS: 0,257
IC1 = microchip:93*76?: 8K Microwire Compatible Serial EEPROM Source: http://ww1.microchip.com/downloads/en/DeviceDoc/21796H.pdf; FARNELL: 1556164; MBM: 1; OC_FARNELL: unknown; OC_NEWARK: unknown; PREIS: 0,274
IC2 = ft2232h:FT2232HL: LQFP 64 packaging; FARNELL: 1697461; MBM: 1; PREIS: 6,54
IC3 IC7 = analog-devices:ADA4941-1: Single-Supply, Differential 18-Bit ADC Driver; FARNELL: 2461018; MBM: 1; PACKAGE: LFCSP_VD-CP-8-2; PREIS: 2,66
IC4 = analog-devices:AD7903: AD7903 Dual Differential 16-Bit, 1 MSPS PulSAR ADC 12.0 mW in QSOP; FARNELL: 2401640; MBM: 1; PREIS: 24,74
IC5 = analog-devices:ADR435: Voltage Reference; FARNELL: 2305780; MBM: 1; PACKAGE: MSOP-8; PREIS: 5,42
IC6 = texas:TPS736XX: TPS736xx Cap-Free, NMOS, 400-mA Low-Dropout Regulator with Reverse Current Protection; FARNELL: 1755496; MBM: 1; PREIS: 2,09
IC8 = xilinx_devices_V6:6SLX9TQG144: Xilinx FPGA: 6SLX9TQG144; DIGIKEY: 122-1747-ND
IC9 = analog-devices:AD5754RBREZ: DAC; FARNELL: 1786049; MBM: 1; MPN: AD5752RBREZ; PACKAGE: TSSOP-24; PREIS: 16,46; SUPPLIER: Analog Devices
IC10 = analog-devices:REF192GSZ: Precision Micropower, Low Dropout Voltage References; FARNELL: 9605207; MBM: 1; MPN: REF192GSZ; PACKAGE: SOIC-8; PREIS: 3,28; SUPPLIER: Analog Devices
IC11 = pachl-custom:M25P80: Serial Flash Memory 8Mb; DIGIKEY: M25P80-VMN6TPCT-ND
IC12 = linear:78L*: POSITOIV-VOLTAGE REGULATORS Output up to 100 mA Source: http://focus.ti.com/lit/ds/symlink/ua78l05.pdf; FARNELL: 1366573; MBM: 1; PREIS: 0,276
IC13 = linear:79L*: Negative Voltage Regulator; FARNELL: 1467770; MBM: 1; PREIS: 0,295
IC14 = texas:LM3671: LM3671 2-MHz, 600-mA Step-Down DC-DC Converter Farnell Order Numbers: MF-3.3 : 1685767 MF-2.5 : 2492196 MF-1.8 : 1685654 MF-1.5 : 2492195 MF-ADJ: 1008256; FARNELL: 1685767; MBM: 1; PREIS: 0,704
IC15 = texas:LM3671: LM3671 2-MHz, 600-mA Step-Down DC-DC Converter Farnell Order Numbers: MF-3.3 : 1685767 MF-2.5 : 2492196 MF-1.8 : 1685654 MF-1.5 : 2492195 MF-ADJ: 1008256; FARNELL: 1685653; MBM: 1; PREIS: 0,46
IC16 = linear:LT1945: LT1945 Dual Micropower DC/DC Converter with Positive and Negative Outputs; DIGIKEY: 505-LT1945EMS#PBF-ND
IC17-IC19 = linear:OPA*-SOT23: Single Operational Amplifier Low Power, Single-Supply, Rail-To-Rail Operational Amplifier Source: http://focus.ti.com/lit/ds/symlink/opa2345.pdf; DIGIKEY: NCV20071SN2T1GOSCT-ND
IC20 = memory-sram:CY7C1049CV33: 4-Mbit (512K x 8) Static RAM Source: CYPRESS cy7c1049cv33_8.pdf
JMP1-JMP3 = jump-0r-smd:0R-JUMP: SMD 0R 0805 Jumper
JP2 JP3 = pinhead-1:PINHD-2X3: PIN HEADER
L1 L5 = rcl:L-EU: INDUCTOR, European symbol; DIGIKEY: 445-174925-1-ND; SPICEPREFIX: L
L2 L3 = inductor-coilcraft:DO3314: DO3314; FARNELL: 2457514; MBM: 1; PREIS: 1,70
L4 = rcl:L-US: INDUCTOR, American symbol; FARNELL: 1515671; MBM: 5; PREIS: 0,067
LED LED1 LED2 = led:LED: LED OSRAM: - CHIPLED LG R971, LG N971, LY N971, LG Q971, LY Q971, LO R971, LY R971 LH N974, LH R974 LS Q976, LO Q976, LY Q976 LO Q996 - Hyper CHIPLED LW Q18S LB Q993, LB Q99A, LB R99A - SideLED LS A670, LO A670, LY A670, LG A670, LP A670 LB A673, LV A673, LT A673, LW A673 LH A674 LY A675 LS A676, LA A676, LO A676, LY A676, LW A676 LS A679, LY A679, LG A679 - Hyper Micro SIDELED® LS Y876, LA Y876, LO Y876, LY Y876 LT Y87S - SmartLED LW L88C, LW L88S LB L89C, LB L89S, LG L890 LS L89K, LO L89K, LY L89K LS L896, LA L896, LO L896, LY L896 - TOPLED LS T670, LO T670, LY T670, LG T670, LP T670 LSG T670, LSP T670, LSY T670, LOP T670, LYG T670 LG T671, LOG T671, LSG T671 LB T673, LV T673, LT T673, LW T673 LH T674 LS T676, LA T676, LO T676, LY T676, LB T676, LH T676, LSB T676, LW T676 LB T67C, LV T67C, LT T67C, LS T67K, LO T67K, LY T67K, LW E67C LS E67B, LA E67B, LO E67B, LY E67B, LB E67C, LV E67C, LT E67C LW T67C LS T679, LY T679, LG T679 LS T770, LO T770, LY T770, LG T770, LP T770 LB T773, LV T773, LT T773, LW T773 LH T774 LS E675, LA E675, LY E675, LS T675 LS T776, LA T776, LO T776, LY T776, LB T776 LHGB T686 LT T68C, LB T68C - Hyper Mini TOPLED® LB M676 - Mini TOPLED Santana® LG M470 LS M47K, LO M47K, LY M47K Source: http://www.osram.convergy.de LUXEON: - LUMILED® LXK2-PW12-R00, LXK2-PW12-S00, LXK2-PW14-U00, LXK2-PW14-V00 LXK2-PM12-R00, LXK2-PM12-S00, LXK2-PM14-U00 LXK2-PE12-Q00, LXK2-PE12-R00, LXK2-PE12-S00, LXK2-PE14-T00, LXK2-PE14-U00 LXK2-PB12-K00, LXK2-PB12-L00, LXK2-PB12-M00, LXK2-PB14-N00, LXK2-PB14-P00, LXK2-PB14-Q00 LXK2-PR12-L00, LXK2-PR12-M00, LXK2-PR14-Q00, LXK2-PR14-R00 LXK2-PD12-Q00, LXK2-PD12-R00, LXK2-PD12-S00 LXK2-PH12-R00, LXK2-PH12-S00 LXK2-PL12-P00, LXK2-PL12-Q00, LXK2-PL12-R00 Source: www.luxeon.com KINGBRIGHT: KA-3528ASYC Source: www.kingbright.com; FARNELL: 1685068; MBM: 1; PREIS: 0,489
Q1 Q2 = transistor-fet:N-MOSFET: N-MOSFET; LCSC: C30010
Q3 = transistor-fet:TSM2311CX: 20V P-Channel MOSFET; LCSC: C332106; MPN: AO3415; PACKAGE: SOT-23-3; SUPPLIER: PUOLOP
R1-R6 R9 R17 R18 R61 R63-R66 = rcl:R-EU_: RESISTOR, European symbol; SPICEPREFIX: R
R7 R8 R21 R31-R34 R44 R48 R53 R54 R57-R60 R62 R67 = rcl:R-EU_: RESISTOR, European symbol
R10 R11 = rcl:R-EU_: RESISTOR, European symbol; BUERKLIN: 26E756; MBM: 10; PREIS: 0,03
R12 R16 R27 R30 R39 R45 R68 R69 = rcl:R-EU_: RESISTOR, European symbol; FARNELL: 9330763; MBM: 10; PREIS: 0,0013
R13 R20 R22 R24 R28 R37 R40 R42 R46 R49 R51 R55 = rcl:R-EU_: RESISTOR, European symbol; FARNELL: 1688472; MBM: 10; PREIS: 0,0013
R14 R19 R29 R35 R36 R38 R41 R43 R47 R50 R52 R56 = rcl:R-EU_: RESISTOR, European symbol; FARNELL: 1717605; MBM: 10; PREIS: 0,0013
R15 R23 = rcl:R-EU_: RESISTOR, European symbol; FARNELL: 2141566; MBM: 10; PREIS: 0,0015
R25 = rcl:R-EU_: RESISTOR, European symbol; FARNELL: 9331573; MBM: 10; PREIS: 0,0016
R26 = rcl:MOV-EU_: Varistor; DIGIKEY: 118-ZV25K1206201NIR1CT-ND
RST SJ1 = jumper:SJ: SMD solder JUMPER
X1 = crystal:ABM: ABM8G ULTRA MINIATURE CERAMIC GLASS SEALED SMD CRYSTAL; FARNELL: 2308707; MBM: 1; PREIS: 0,663
X2 = con-berg:PN61729-S: BERG USB connector; OC_FARNELL: unknown; OC_NEWARK: unknown
X3 = con-subd:F25: SUB-D; OC_FARNELL: unknown; OC_NEWARK: unknown
X4 = con-subd:F15: SUB-D; OC_FARNELL: unknown; OC_NEWARK: unknown
X5 = crystal:ASE: 3.3Vdc CMOS SMD CRYSTAL CLOCK OSCILLATOR SOurce: www.abracon.com; DIGIKEY: 535-9577-1-ND; OC_FARNELL: unknown; OC_NEWARK: unknown